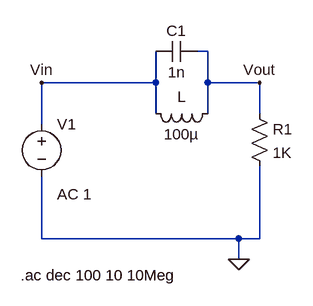
[diagram p0: schematic RLC Band stop Filter-asc..asc]
RLC Band stop Filter-asc..asc, the LTspice schematic file:
Version 4.1
SHEET 1 880 680
WIRE 192 96 176 96
WIRE 112 144 112 96
WIRE 112 144 -64 144
WIRE 192 144 192 96
WIRE 272 144 192 144
WIRE 112 192 112 144
WIRE 192 192 192 144
WIRE 272 192 272 144
WIRE -64 208 -64 144
WIRE -64 384 -64 288
WIRE 240 384 -64 384
WIRE 272 384 272 272
WIRE 272 384 240 384
WIRE 240 416 240 384
FLAG 240 416 0
FLAG -64 144 Vin
FLAG 272 144 Vout
SYMBOL cap 176 80 R90
WINDOW 0 0 32 VBottom 2
WINDOW 3 32 32 VTop 2
SYMATTR InstName C1
SYMATTR Value 1n
SYMBOL ind 208 176 R90
WINDOW 0 5 56 VBottom 2
WINDOW 3 32 56 VTop 2
SYMATTR InstName L
SYMATTR Value 100µ
SYMBOL res 256 176 R0
SYMATTR InstName R1
SYMATTR Value 1K
SYMBOL voltage -64 192 R0
WINDOW 123 24 124 Left 2
WINDOW 39 0 0 Left 0
SYMATTR InstName V1
SYMATTR Value ""
SYMATTR Value2 AC 1
TEXT -96 440 Left 2 !.ac dec 100 10 10Meg

The netlist it stands for:
* RLC Band stop Filter-asc..asc
C1 Vout Vin 1n
L Vout Vin 100µ
R1 Vout 0 1K
V1 Vin 0 AC 1
.ac dec 100 10 10Meg
.backanno
.end